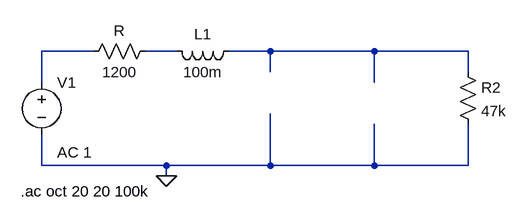
[diagram p0: schematic cartridge loading.asc]
cartridge loading.asc, the LTspice schematic file:
Version 4
SHEET 1 880 680
WIRE 96 112 16 112
WIRE 224 112 176 112
WIRE 368 112 304 112
WIRE 528 112 368 112
WIRE 672 112 528 112
WIRE 368 144 368 112
WIRE 672 144 672 112
WIRE 16 160 16 112
WIRE 528 160 528 112
WIRE 16 288 16 240
WIRE 208 288 16 288
WIRE 368 288 368 208
WIRE 368 288 208 288
WIRE 528 288 528 224
WIRE 528 288 368 288
WIRE 672 288 672 224
WIRE 672 288 528 288
WIRE 208 304 208 288
FLAG 208 304 0
SYMBOL res 192 96 R90
WINDOW 0 0 56 VBottom 2
WINDOW 3 32 56 VTop 2
SYMATTR InstName R
SYMATTR Value 1200
SYMBOL ind 320 96 R90
WINDOW 0 5 56 VBottom 2
WINDOW 3 32 56 VTop 2
SYMATTR InstName L1
SYMATTR Value 100m
SYMBOL res 656 128 R0
SYMATTR InstName R2
SYMATTR Value 47k
SYMBOL voltage 16 144 R0
WINDOW 123 24 124 Left 2
WINDOW 39 0 0 Left 2
SYMATTR Value2 AC 1
SYMATTR InstName V1
SYMATTR Value ""
TEXT -16 328 Left 2 !.ac oct 20 20 100k

The netlist it stands for:
* cartridge loading.asc
R N002 N001 1200
L1 N003 N002 100m
R2 N003 0 47k
V1 N001 0 AC 1
.ac oct 20 20 100k
.backanno
.end